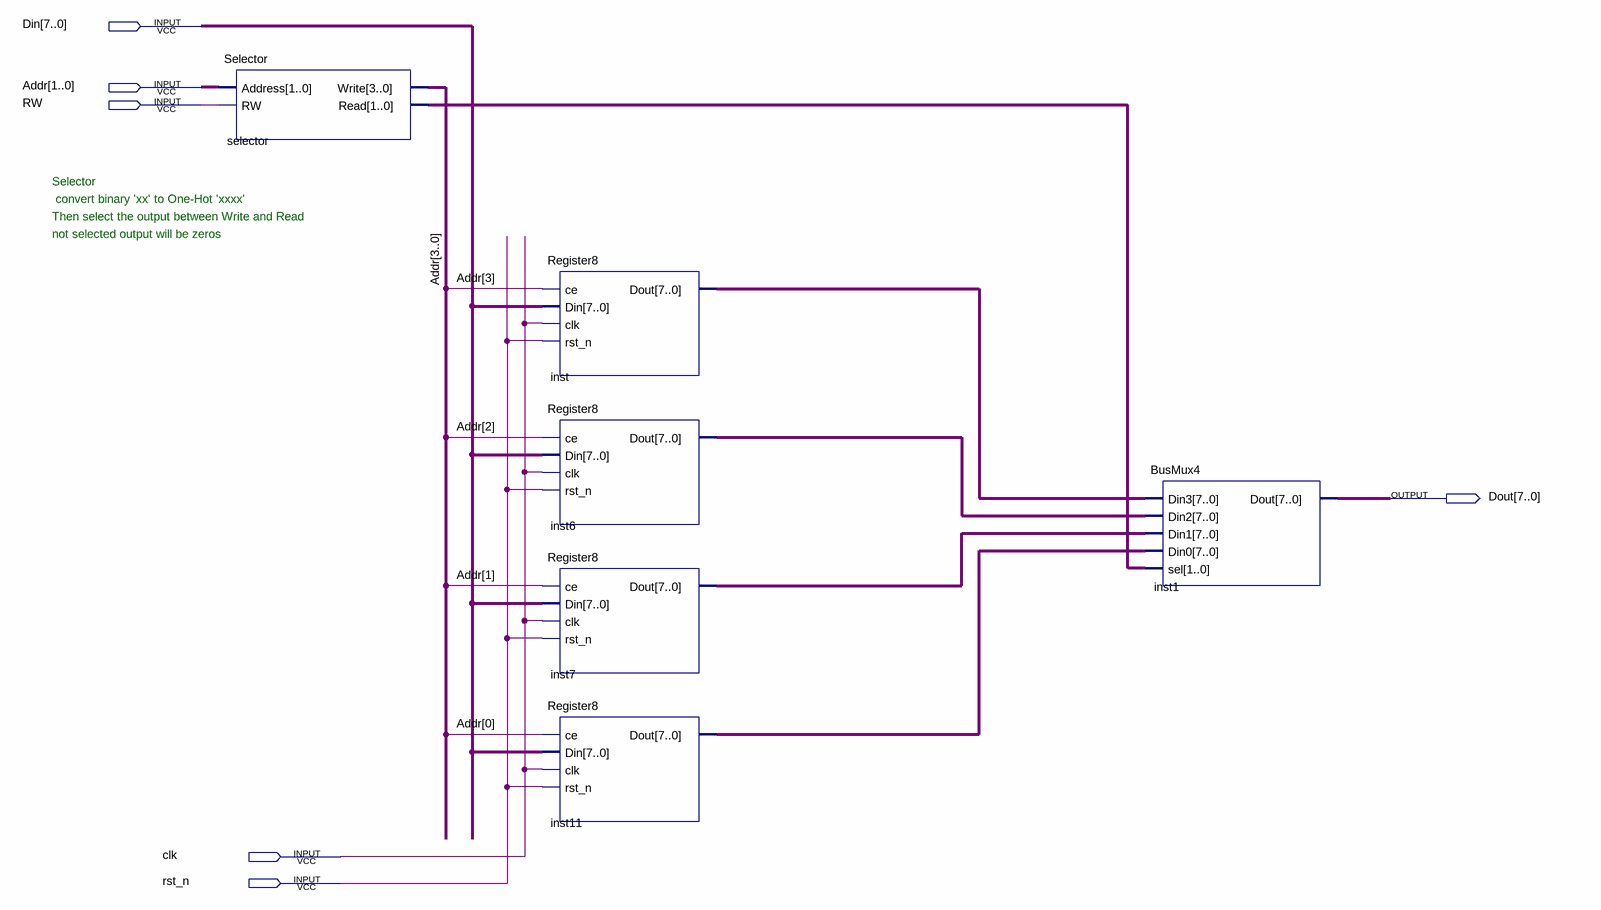
[diagram p0: schematic sheet]
// Quartus schematic SRAM.bdf as structural Verilog: 6 symbols, 6 pins
module SRAM (
  input  [7:0] Din,
  input  [3:0] Addr,
  input  RW,
  input  clk,
  input  rst_n,
  output [7:0] Dout
);

  wire [1:0] selector_read;
  wire [7:0] inst6_dout, inst7_dout, inst11_dout, inst_dout;

  Selector selector (.Address(Addr[1:0]), .RW(RW), .Write(Addr), .Read(selector_read));
  Register8 inst (.ce(Addr[3]), .Din(Din), .clk(clk), .rst_n(rst_n), .Dout(inst_dout));
  Register8 inst6 (.ce(Addr[2]), .Din(Din), .clk(clk), .rst_n(rst_n), .Dout(inst6_dout));
  Register8 inst7 (.ce(Addr[1]), .Din(Din), .clk(clk), .rst_n(rst_n), .Dout(inst7_dout));
  Register8 inst11 (.ce(Addr[0]), .Din(Din), .clk(clk), .rst_n(rst_n), .Dout(inst11_dout));
  BusMux4 inst1 (
    .Din3(inst_dout), .Din2(inst6_dout), .Din1(inst7_dout), .Din0(inst11_dout), .sel(selector_read),
    .Dout(Dout));

  // Notes on the sheet:
  //   Selector
  //    convert binary 'xx' to One-Hot 'xxxx' 
  //   Then select the output between Write and Read 
  //   not selected output will be zeros
endmodule
